# Altium project OpenFAN_Micro.PrjPcb
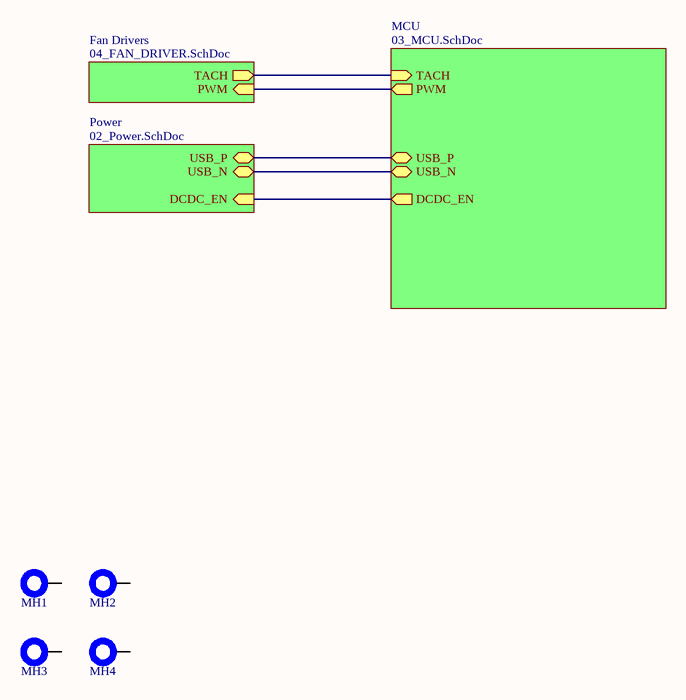
[diagram p0: 01_Top.SchDoc]
4 sheets, 60 parts. Net scope: hierarchical (ports join the sheet entries above them; power ports are global).
Board file: OpenFAN_Micro.PcbDoc
Sheets:
  01_Top.SchDoc
    Power = 02_Power.SchDoc
    MCU = 03_MCU.SchDoc
    Fan Drivers = 04_FAN_DRIVER.SchDoc

## Sheet 01_Top.SchDoc: Overview
size A4; Author: Sasa Karanovic; Organization: Altium Limited; Revision: 04; SheetNumber: 1; SheetTotal: 4; PrjDate: 2023-09-29; PrjTime: 23:04; PrjName: OpenFAN Micro

### Parts
MH1  Mounting Hole  [MH-M3]  (value not drawn)  (no BOM)
MH2  Mounting Hole  [MH-M3]  (value not drawn)  (no BOM)
MH3  Mounting Hole  [MH-M3]  (value not drawn)  (no BOM)
MH4  Mounting Hole  [MH-M3]  (value not drawn)  (no BOM)

### Sub-sheets
Fan Drivers = 04_FAN_DRIVER.SchDoc: TACH (out), PWM (in)
MCU = 03_MCU.SchDoc: USB_N (bidir), USB_P (bidir), DCDC_EN (out), TACH (in), PWM (out)
Power = 02_Power.SchDoc: USB_N (bidir), USB_P (bidir), DCDC_EN (in)

### Nets
DCDC_EN: sheet Power/DCDC_EN, sheet MCU/DCDC_EN
FAN_PWM: sheet MCU/PWM, sheet Fan Drivers/PWM
FAN_TACH: sheet MCU/TACH, sheet Fan Drivers/TACH
USB_N: sheet Power/USB_N, sheet MCU/USB_N
USB_P: sheet Power/USB_P, sheet MCU/USB_P

Not connected (* = marked no-connect by the designer): MH1 0; MH2 0; MH3 0; MH4 0

### Notes on the sheet
- Page:
- Drawn By:
- Project:
- Rev:
- Time:
- Date:
- Sheet
- of

### Library data of the parts
MH1-MH4 = Mounting Hole - M3: Board Mounting Hole

## Sheet 02_Power.SchDoc: Power section
size A4; Author: Sasa Karanovic; Organization: Altium Limited; Revision: 04; SheetNumber: 2; SheetTotal: 4; PrjDate: 2023-09-29; PrjTime: 23:04; PrjName: OpenFAN Micro
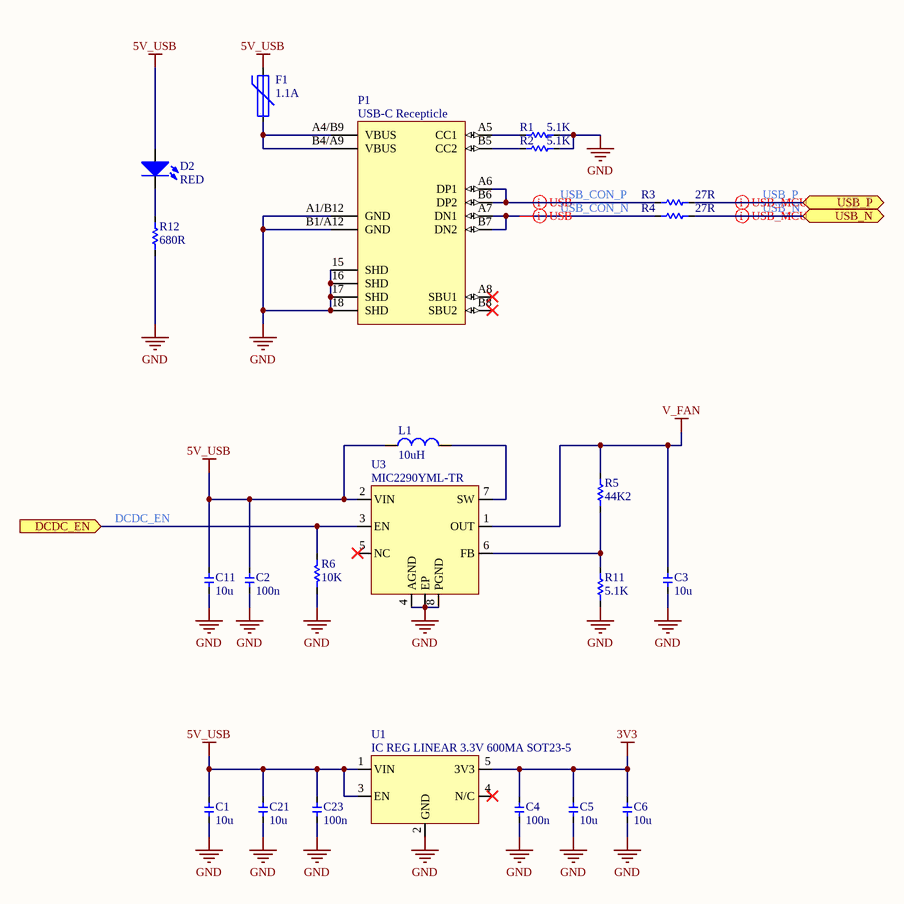
[diagram p1: 02_Power.SchDoc]

### Parts
C1  value 10u  [0402]  (hidden comment: Cap)
C2  value 100n  [0402]  (hidden comment: Cap)
C3  value 10u  [0805]  (hidden comment: Cap)
C4  value 100n  [0402]  (hidden comment: Cap)
C5  value 10u  [0603 - CAP]  (hidden comment: Cap)
C6  value 10u  [0603 - CAP]  (hidden comment: Cap)
C11  value 10u  [0402]  (hidden comment: Cap)
C21  value 10u  [0603 - CAP]  (hidden comment: Cap)
C23  value 100n  [0402]  (hidden comment: Cap)
D2  RED  [CD1608-0603]
F1  value 1.1A  [FUSE_2114X12N]  (hidden comment: Fuse)
L1  value 10uH  [INDC3218X20N]  (hidden comment: Inductor)
P1  USB-C Recepticle  [GCT_USB4105-GF-A]
R1  value 5.1K  [0402]  (hidden comment: Res)
R2  value 5.1K  [0402]  (hidden comment: Res)
R3  value 27R  [0402]  (hidden comment: Res)
R4  value 27R  [0402]  (hidden comment: Res)
R5  value 44K2  [0402]  (hidden comment: Res)
R6  value 10K  [0402]  (hidden comment: Res)
R11  value 5.1K  [0402]  (hidden comment: Res)
R12  value 680R  [0402]  (hidden comment: Res)
U1  IC REG LINEAR 3.3V 600MA SOT23-5  [SOT-23-5]
U3  MIC2290YML-TR  [SON50P200X85_HS-9N]

### Ports
DCDC_EN (in), USB_N (bidir), USB_P (bidir)

### Nets
3V3: C4.2 C5.2 C6.2 U1.5(3V3)
5V_USB: C1.2 C2.2 C11.2 C21.2 C23.2 D2.A F1.2 L1.1 U1.1(VIN) U1.3(EN) U3.2(VIN)
GND: C1.1 C2.1 C3.1 C4.1 C5.1 C6.1 C11.1 C21.1 C23.1 P1.15(SHD) P1.16(SHD) P1.17(SHD) P1.18(SHD) P1.A1/B12(GND) P1.B1/A12(GND) R1.2 R2.2 R6.1 R11.1 R12.1 U1.2(GND) U3.4(AGND) U3.8(PGND) U3.EP
V_FAN: C3.2 R5.2 U3.1(OUT)
DCDC_EN: R6.2 U3.3(EN) ; port DCDC_EN
USB_CON_N: P1.A7(DN1) P1.B7(DN2) R4.2
USB_CON_P: P1.A6(DP1) P1.B6(DP2) R3.2
USB_N: R4.1 ; port USB_N
USB_P: R3.1 ; port USB_P
NetD2_K: D2.K R12.2
NetF1_1: F1.1 P1.A4/B9(VBUS) P1.B4/A9(VBUS)
NetL1_2: L1.2 U3.7(SW)
NetP1_A5: P1.A5(CC1) R1.1
NetP1_B5: P1.B5(CC2) R2.1
NetR5_1: R5.1 R11.2 U3.6(FB)

Not connected (* = marked no-connect by the designer): P1 A8(SBU1)* B8(SBU2)*; U1 4(N/C)*; U3 5(NC)*

### Layout directives
differential pair; differential pair class USB_90: USB_N, USB_P
differential pair; differential pair class USB; differential pair class USB_90: USB_CON_N, USB_CON_P

### Notes on the sheet
- Page:
- Drawn By:
- Project:
- Rev:
- Time:
- Date:
- Sheet
- of

### Library data of the parts
C1 = Cap: Capacitor; Manufacturer: Murata Electronics; Manufacturer Part Number: GRM155R61A106ME11D; Voltage: 10V; Temp Rating: X7R; Distributor Part Number: C408132; Distributor: LCSC
C2 C4 C23 = Cap: Capacitor; Manufacturer: Samsung Electro-Mechanics; Manufacturer Part Number: CL05B104KA5NNNC; Voltage: 25V; Temp Rating: X7R; Distributor Part Number: C155422; Distributor: LCSC
C3 = Cap: Capacitor; Manufacturer: Samsung Electro-Mechanics; Manufacturer Part Number: CL21B106KOQNNNE; Voltage: 16V; Temp Rating: X7R; Distributor Part Number: C95841; Distributor: LCSC
C5 C6 C21 = Cap: Capacitor; Manufacturer: Murata Electronics; Manufacturer Part Number: GRM188Z71A106KA73D; Voltage: 10V; Temp Rating: X7R; Distributor Part Number: C2959727; Distributor: LCSC
C11 = Cap: Capacitor; Manufacturer: Murata Electronics; Manufacturer Part Number: GRM155R61A106ME11D; Temp Rating: X7R; Voltage: 10V; Distributor Part Number: C408132; Distributor: LCSC
D2 = LED-0603-5mA-RED: 5mA 26.05mcd 无色透明透镜 -30℃~+85℃ 631nm Red 130° 50mW 2V 0603 Light Emitting Diodes (LED) ROHS; Manufacturer: Lite-On; Manufacturer Part Number: LTST-C193KRKT-5A; Distributor: LCSC; Distributor Part Number: C157741; Color: RED; Test Current: 5mA
F1 = Fuse-PTC-0805-0.5A_6V: 6V 1.1A 40A 2.2A 0805 Resettable Fuses ROHS; Manufacturer: BOURNS; Manufacturer Part Number: MF-PSMF110X-2; Distributor: LCSC; Distributor Part Number: C89658
L1 = L-2520-10uH 850mA 480mOhm: 10 µH Shielded Drum Core, Wirewound Inductor 850 mA 480mOhm Max 1008 (2520 Metric); Manufacturer: Pulse Electronics; Manufacturer Part Number: BWMR00252012100M00; Distributor: LCSC; Distributor Part Number: C3033274
P1 = USB-C Recepticle -USB-TYPE-C-019: 3A 1 Surface Mount 16P Female -25℃~+85℃ Type-C SMD USB Connectors ROHS; Manufacturer: DEALON; Manufacturer Part Number: USB-TYPE-C-019; Distributor Part Number: C2927039; Distributor: LCSC
R1 R2 R11 = Res: Resistor; Manufacturer: YAGEO; Manufacturer Part Number: RC0402FR-075K1L; Power Rating: 100mW; Tolerance: 1%; Distributor: LCSC; Distributor Part Number: C105872
R3 R4 = Res: Resistor; Manufacturer: YAGEO; Manufacturer Part Number: RC0402FR-0727RL; Power Rating: 100mW; Tolerance: 1%; Distributor: LCSC; Distributor Part Number: C138021
R5 = R-0603-44K2 1%: 44.2 kOhms ±1% 0.1W, 1/10W Chip Resistor 0603 (1608 Metric) Moisture Resistant Thick Film; Manufacturer: YAGEO; Manufacturer Part Number: RC0402FR-0744K2L; Power Rating: 100mW; Distributor: LCSC; Distributor Part Number: C354260; Tolerance: 1%
R6 = Res: Resistor; Manufacturer: YAGEO; Manufacturer Part Number: RC0402FR-0710KL; Distributor: LCSC; Distributor Part Number: C60490
R12 = R-0603-470R 1%: 470Ω 100mW Thick Film Resistors ±0.5% ±100ppm/℃ 0603 Chip Resistor - Surface Mount ROHS; Manufacturer: YAGEO; Manufacturer Part Number: RC0402FR-10680RL; Tolerance: 1%; Distributor: LCSC; Distributor Part Number: C6378047; Power Rating: 100mW
U1 = AP7366-33W5-7: 600mA null 3.3V positive 6V SOT-25 Linear Voltage Regulators (LDO) ROHS; Manufacturer: Diodes Incorporated; Distributor: LCSC; Distributor Part Number: C526385; Manufacturer Part Number: AP7366-33W5-7
U3 = MIC2290YML-TR: Boost Switching Regulator IC Positive Adjustable 2.5V 1 Output 750mA (Switch) 8-VFDFN Exposed Pad, 8-MLF®; Manufacturer: Microchip Technology; Distributor: LCSC; Distributor Part Number: C144214; Manufacturer Part Number: MIC2290YML-TR

## Sheet 03_MCU.SchDoc: Microcontroller
size A4; Author: Sasa Karanovic; Organization: Altium Limited; Revision: 04; SheetNumber: 3; SheetTotal: 4; PrjDate: 2023-09-29; PrjTime: 23:04; PrjName: OpenFAN Micro
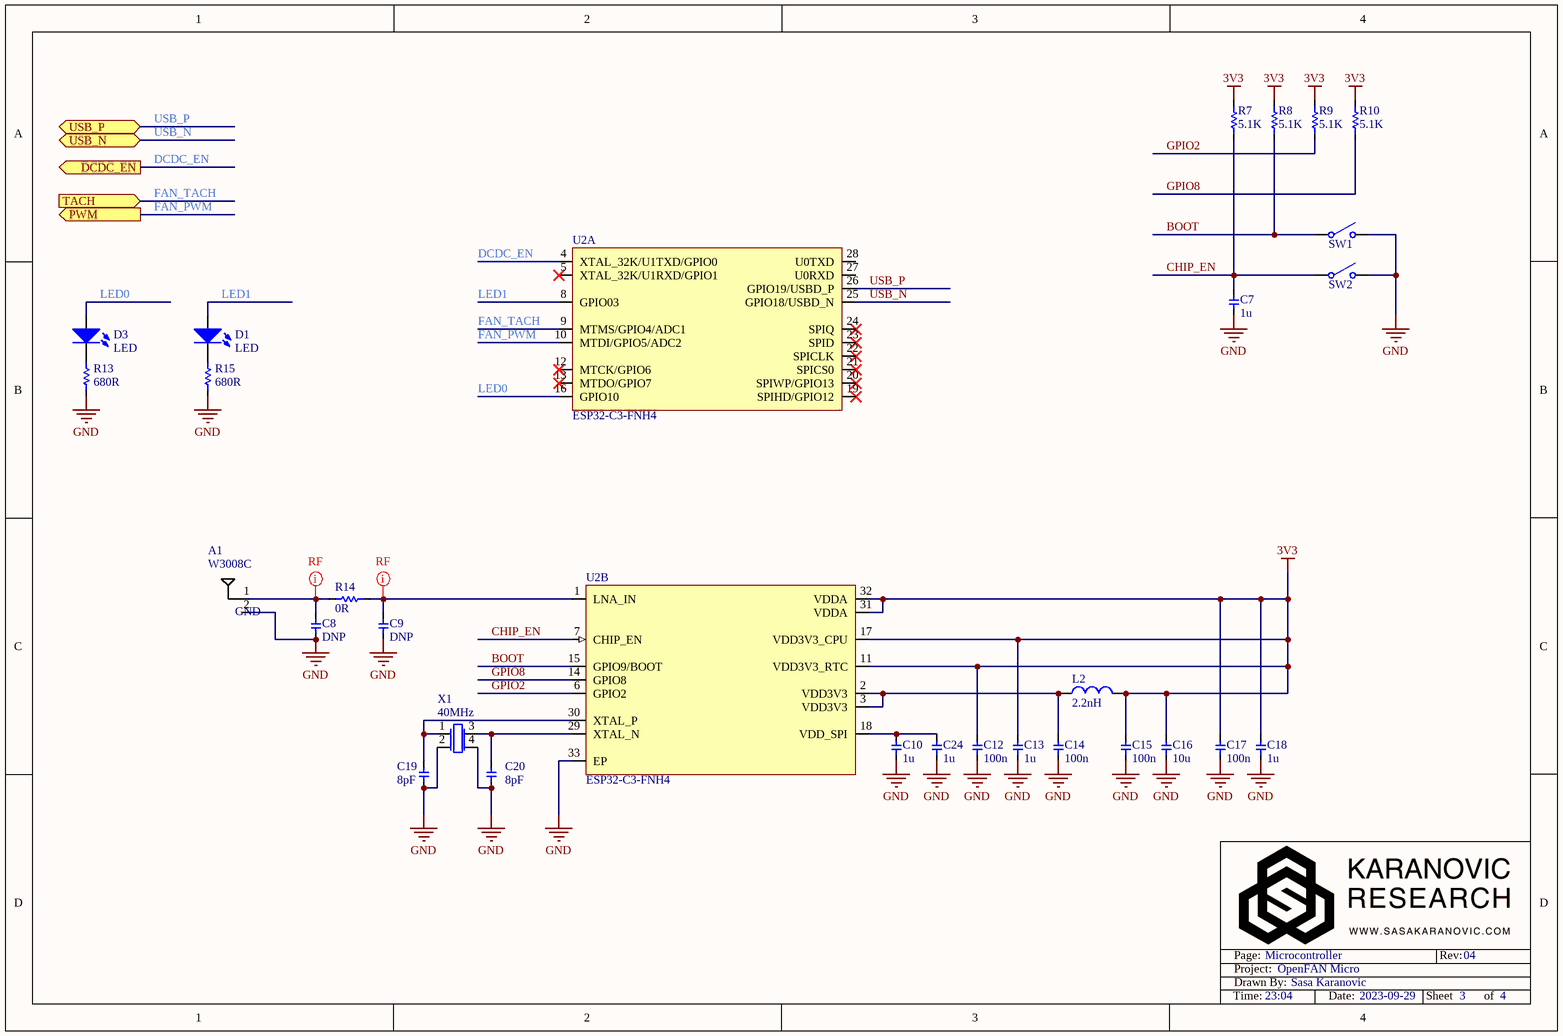
[diagram p2: 03_MCU.SchDoc]

### Parts
A1  value W3008C  [W3008C]  (hidden comment: Antenna)
C7  value 1u  [0402]  (hidden comment: Cap)
C8  value DNP  [0402]  (hidden comment: Cap)  (no BOM)
C9  value DNP  [0402]  (hidden comment: Cap)  (no BOM)
C10  value 1u  [0402]  (hidden comment: Cap)
C12  value 100n  [0402]  (hidden comment: Cap)
C13  value 1u  [0402]  (hidden comment: Cap)
C14  value 100n  [0402]  (hidden comment: Cap)
C15  value 100n  [0402]  (hidden comment: Cap)
C16  value 10u  [0402]  (hidden comment: Cap)
C17  value 100n  [0402]  (hidden comment: Cap)
C18  value 1u  [0402]  (hidden comment: Cap)
C19  value 8pF  [0402]  (hidden comment: Cap)
C20  value 8pF  [0402]  (hidden comment: Cap)
C24  value 1u  [0402]  (hidden comment: Cap)
D1  LED  [CD1608-0603]
D3  LED  [CD1608-0603]
L2  value 2.2nH  [0402]  (hidden comment: Inductor)
R7  value 5.1K  [0402]  (hidden comment: Res)
R8  value 5.1K  [0402]  (hidden comment: Res)
R9  value 5.1K  [0402]  (hidden comment: Res)
R10  value 5.1K  [0402]  (hidden comment: Res)
R13  value 680R  [0402]  (hidden comment: Res)
R14  value 0R  [0402]  (hidden comment: Res)
R15  value 680R  [0402]  (hidden comment: Res)
SW1  Switch  [Switch-XDTD-0304-215]  (value not drawn)
SW2  Switch  [Switch-XDTD-0304-215]  (value not drawn)
U2  ESP32-C3-FNH4  [QFN50P500X500X100_HS-33N]  (parts A,B of 2)
X1  40MHz  [XTAL-4LEAD-2016]

### Ports
DCDC_EN (out), PWM (out), TACH (in), USB_N (bidir), USB_P (bidir)

### Nets
3V3: C12.2 C13.2 C15.2 C16.2 C17.2 C18.2 L2.2 R7.1 R8.1 R9.1 R10.1 U2.11(VDD3V3_RTC) U2.17(VDD3V3_CPU) U2.31(VDDA) U2.32(VDDA)
GND: A1.2 C7.1 C8.1 C9.1 C10.1 C12.1 C13.1 C14.1 C15.1 C16.1 C17.1 C18.1 C19.2 C20.1 C24.1 R13.1 R15.1 SW1.2(COMMON2) SW2.2(COMMON2) U2.33(EP) X1.2(GND) X1.4(GND)
BOOT: R8.2 SW1.1(COMMON1) U2.15(GPIO9/BOOT)
CHIP_EN: C7.2 R7.2 SW2.1(COMMON1) U2.7(CHIP_EN)
DCDC_EN: U2.4(XTAL_32K/U1TXD/GPIO0) ; port DCDC_EN
FAN_PWM: U2.10(MTDI/GPIO5/ADC2) ; port PWM
FAN_TACH: U2.9(MTMS/GPIO4/ADC1) ; port TACH
GPIO2: R9.2 U2.6(GPIO2)
GPIO8: R10.2 U2.14(GPIO8)
LED0: D3.A U2.16(GPIO10)
LED1: D1.A U2.8(GPIO03)
USB_N: U2.25(GPIO18/USBD_N) ; port USB_N
USB_P: U2.26(GPIO19/USBD_P) ; port USB_P
NetA1_1: A1.1 C8.2 R14.1
NetC9_2: C9.2 R14.2 U2.1(LNA_IN)
NetC10_2: C10.2 C24.2 U2.18(VDD_SPI)
NetC14_2: C14.2 L2.1 U2.2(VDD3V3) U2.3(VDD3V3)
NetC19_1: C19.1 U2.30(XTAL_P) X1.1(OSC1)
NetC20_2: C20.2 U2.29(XTAL_N) X1.3(OSC3)
NetD1_K: D1.K R15.2
NetD3_K: D3.K R13.2

Not connected (* = marked no-connect by the designer): U2 5(XTAL_32K/U1RXD/GPIO1)* 12(MTCK/GPIO6)* 13(MTDO/GPIO7)* 19(SPIHD/GPIO12)* 20(SPIWP/GPIO13)* 21(SPICS0)* 22(SPICLK)* 23(SPID)* 24(SPIQ)* 27(U0RXD) 28(U0TXD)

### Layout directives
net class RF: NetA1_1, NetC9_2

### Notes on the sheet
- Page:
- Drawn By:
- Project:
- Rev:
- Time:
- Date:
- Sheet
- of
- (in symbol ANT-W3008C) GND

### Library data of the parts
A1 = ANT-W3008C: 2.4GHz Bluetooth, WLAN, Zigbee™ Chip RF Antenna 2.4GHz ~ 2.483GHz 1.3dBi Solder Surface Mount; Manufacturer: Pulse Electronics; Manufacturer Part Number: W3008C; Distributor: LCSC; Distributor Part Number: C581403
C7 C10 C13 C18 C24 = Cap: Capacitor; Manufacturer: Samsung Electro-Mechanics; Manufacturer Part Number: CL05A105KO5NNNC; Temp Rating: X5R; Voltage: 16V; Distributor Part Number: C29266; Distributor: LCSC
C8 C9 = Cap: Capacitor
C12 C14 C15 C17 = Cap: Capacitor; Manufacturer: Samsung Electro-Mechanics; Manufacturer Part Number: CL05B104KA5NNNC; Temp Rating: X7R; Voltage: 25V; Distributor Part Number: C155422; Distributor: LCSC
C16 = Cap: Capacitor; Manufacturer: Murata Electronics; Manufacturer Part Number: GRM155R61A106ME11D; Voltage: 10V; Distributor Part Number: C408132; Distributor: LCSC
C19 C20 = Cap: Capacitor; Manufacturer: Samsung Electro-Mechanics; Manufacturer Part Number: CL05C080DB51PNC; Temp Rating: NP0; Voltage: 50V; Distributor Part Number: C472443; Distributor: LCSC
D1 D3 = LED: Typical RED GaAs LED; Manufacturer: ams-OSRAM USA INC.; Manufacturer Part Number: LW Q38G-Q2OO-3K5L-1; Value: Diffused White LED; Distributor: LCSC; Distributor Part Number: C2900098
L2 = Inductor - 2.2nH: 1.1A 2.2nH 100mΩ 0603 Inductors (SMD) ROHS; Manufacturer: Murata Electronics; Manufacturer Part Number: LQG15HS2N2B02D; Distributor: LCSC; Distributor Part Number: C162540
R7-R10 = Res: as R1 on sheet 02_Power; Distributor: LCSC; Distributor Part Number: C105872
R13 R15 = Res: Resistor; Manufacturer: YAGEO; Manufacturer Part Number: RC0402FR-10680RL; Distributor: LCSC; Distributor Part Number: C6378047
R14 = Res: Resistor; Manufacturer: YAGEO; Manufacturer Part Number: RC0402JR-070RL; Power Rating: 100mW; Tolerance: 5%; Distributor: LCSC; Distributor Part Number: C60485
SW1 SW2 = Switch -XDTD-0304-215: 50mA Surface Mount SPST 100MΩ 100,000 Times 12V 160gf@±50gf SMD Tactile Switches ROHS; Manufacturer: Lian Xin Technology; Manufacturer Part Number: XDTD-0304-215; Distributor: LCSC; Distributor Part Number: C7498203
U2 = ESP32-C3-FNH4: Ultra-Low-Power SoC with RISC-V Single-Core CPU 2.4 GHz Wi-Fi (802.11 b/g/n) and Bluetooth® 5 (LE); Manufacturer: Espressif Systems; Manufacturer Part Number: ESP32-C3FH4; Distributor: LCSC; Distributor Part Number: C2858491
X1 = XTAL-40MHz-R940000171: 40MHz 9pF ±10ppm SMD2016-4P Crystals ROHS; Manufacturer: TROQ; Manufacturer Part Number: R940000171; Distributor: LCSC; Distributor Part Number: C2929402

## Sheet 04_FAN_DRIVER.SchDoc: Fan Drivers
size A4; Author: Sasa Karanovic; Organization: Altium Limited; Revision: 04; SheetNumber: 4; SheetTotal: 4; PrjDate: 2023-09-29; PrjTime: 23:04; PrjName: OpenFAN Micro
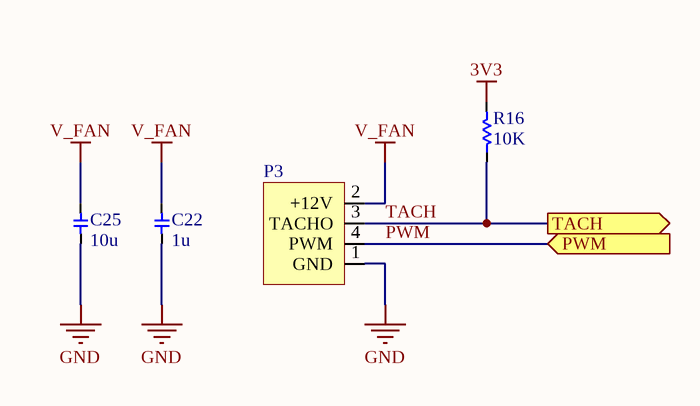
[diagram p3: 04_FAN_DRIVER.SchDoc]

### Parts
C22  value 1u  [0603 - CAP]  (hidden comment: Cap)
C25  value 10u  [0805]  (hidden comment: Cap)
P3  WM4330-ND  [FAN_Connector_4pin]  (value not drawn)
R16  value 10K  [0402]  (hidden comment: Res)

### Ports
PWM (in), TACH (out)

### Nets
3V3: R16.2
GND: C22.1 C25.1 P3.1(GND)
V_FAN: C22.2 C25.2 P3.2(+12V)
PWM: P3.4(PWM) ; port PWM  [project net FAN_PWM]
TACH: P3.3(TACHO) R16.1 ; port TACH  [project net FAN_TACH]

### Notes on the sheet
- Page:
- Drawn By:
- Project:
- Rev:
- Time:
- Date:
- Sheet
- of

### Library data of the parts
C22 = Cap: Capacitor; Manufacturer: YAGEO; Manufacturer Part Number: CC0603KRX7R9BB105; Voltage: 50V; Temp Rating: X7R; Distributor Part Number: C559769; Distributor: LCSC
C25 = Cap: as C3 on sheet 02_Power; Distributor Part Number: C95841; Distributor: LCSC
P3 = Header 4-pin Intel Fan: 4 Positions Header Connector 0.100" (2.54mm) Through Hole Tin; Manufacturer: Molex; Manufacturer Part Number: 0470531000; Distributor: LCSC; Distributor Part Number: C3025061
R16 = Res: as R6 on sheet 02_Power; Distributor: LCSC; Distributor Part Number: C60490

## Nets that join several sheets
3V3: 02_Power (C4.2 C5.2 C6.2 U1.5), 03_MCU (15 pins), 04_FAN_DRIVER (R16.2)
GND: 02_Power (24 pins), 03_MCU (22 pins), 04_FAN_DRIVER (C22.1 C25.1 P3.1)
V_FAN: 02_Power (C3.2 R5.2 U3.1), 04_FAN_DRIVER (C22.2 C25.2 P3.2)
DCDC_EN: 02_Power (R6.2 U3.3), 03_MCU (U2.4)
FAN_PWM: 03_MCU (U2.10), 04_FAN_DRIVER (P3.4)
FAN_TACH: 03_MCU (U2.9), 04_FAN_DRIVER (P3.3 R16.1)
USB_N: 02_Power (R4.1), 03_MCU (U2.25)
USB_P: 02_Power (R3.1), 03_MCU (U2.26)